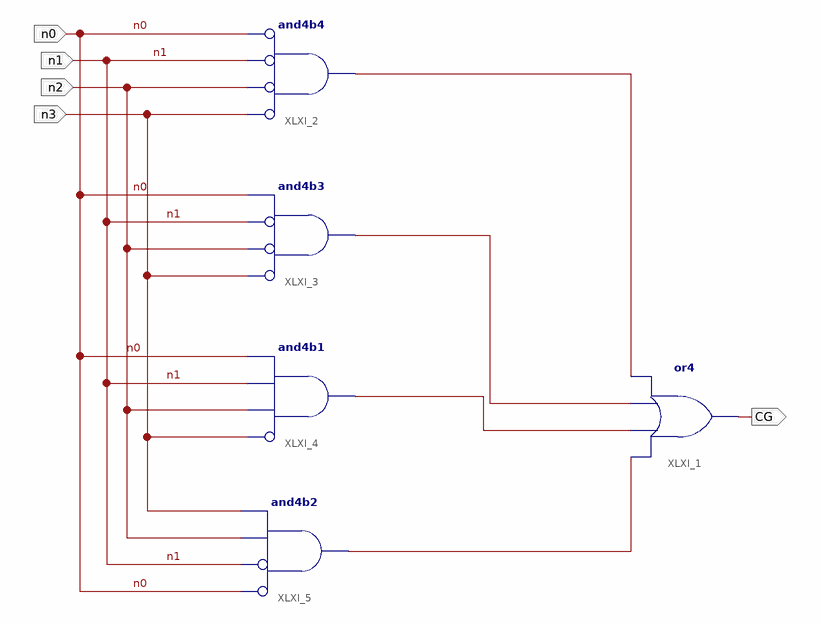
[diagram p0: schematic sheet 1]
// Xilinx ISE schematic g.sch (spartan3e) as structural Verilog: 5 symbols, 5 ports
module g (
  input  n0,
  input  n1,
  input  n2,
  input  n3,
  output CG
);

  wire XLXN_2, XLXN_3, XLXN_4, XLXN_5;

  or XLXI_1 (CG, XLXN_5, XLXN_4, XLXN_3, XLXN_2);
  and XLXI_2 (XLXN_2, ~n3, ~n2, ~n1, ~n0);  // and4b4
  and XLXI_3 (XLXN_3, ~n3, ~n2, ~n1, n0);  // and4b3
  and XLXI_4 (XLXN_4, ~n3, n2, n1, n0);  // and4b1
  and XLXI_5 (XLXN_5, ~n0, ~n1, n2, n3);  // and4b2
endmodule
